# EAGLE design UsbPowerSupply (EAGLE 8.5.2)
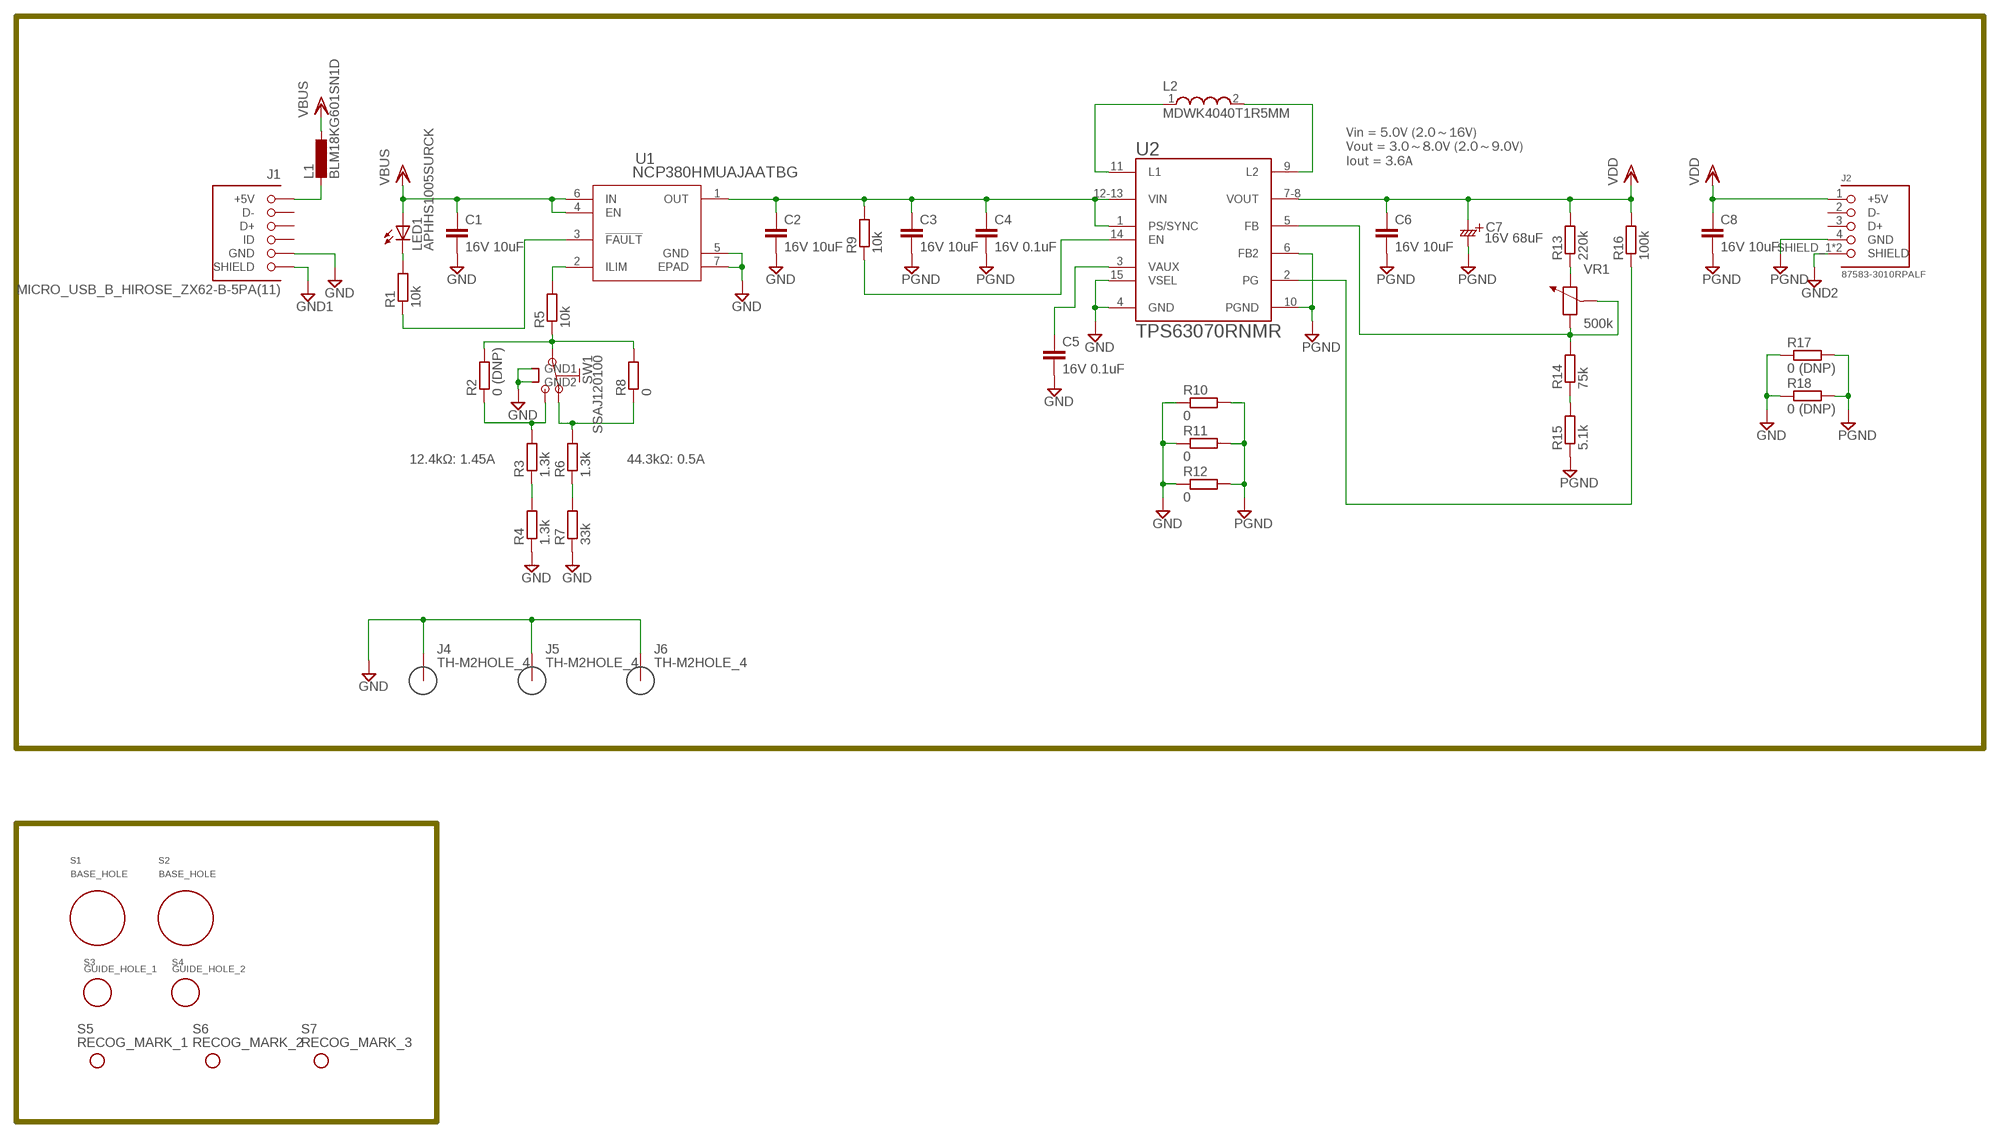
[diagram p0: schematic, sheet 1]

## Parts
C1  16V 10uF  C-EUC0603M  [C0603M]
C2  16V 10uF  C-EUC0603M  [C0603M]
C3  16V 10uF  C-EUC0603M  [C0603M]
C4  16V 0.1uF  C-EUC0402M  [C0402M]
C5  16V 0.1uF  C-EUC0402M  [C0402M]
C6  16V 10uF  C-EUC0603M  [C0603M]
C7  16V 68uF  EEFCX  [EEFCX_7343]
C8  16V 10uF  C-EUC0603M  [C0603M]
J1  MICRO_USB_B_HIROSE_ZX62-B-5PA(11)  [USB_MICRO_B-HIROSE-ZX62-B-5PA(11)]
J2  87583-3010RPALF  [USB_A_FEMALE]
J4  TH-M2HOLE_4  [HOLE_M2_PHI4]
J5  TH-M2HOLE_4  [HOLE_M2_PHI4]
J6  TH-M2HOLE_4  [HOLE_M2_PHI4]
L1  BLM18KG601SN1D  L-EUL1608  [L1608]
L2  MDWK4040T1R5MM  WE-MAPI4020  [WE-MAPI_4020]
LED1  APHHS1005SURCK  LED  [1005]
R1  10k  R-EU_R0402R  [R0402R]
R2  0 (DNP)  R-EU_R0402R  [R0402R]
R3  1.3k  R-EU_R0402R  [R0402R]
R4  1.3k  R-EU_R0402R  [R0402R]
R5  10k  R-EU_R0402R  [R0402R]
R6  1.3k  R-EU_R0402R  [R0402R]
R7  33k  R-EU_R0402R  [R0402R]
R8  0  R-EU_R0402R  [R0402R]
R9  10k  R-EU_R0402R  [R0402R]
R10  0  R-EU_R0402R  [R0402R]
R11  0  R-EU_R0402R  [R0402R]
R12  0  R-EU_R0402R  [R0402R]
R13  220k  R-EU_R0402R  [R0402R]
R14  75k  R-EU_R0402R  [R0402R]
R15  5.1k  R-EU_R0402R  [R0402R]
R16  100k  R-EU_R0402R  [R0402R]
R17  0 (DNP)  R-EU_R0402R  [R0402R]
R18  0 (DNP)  R-EU_R0402R  [R0402R]
S1  BASE_HOLE  [BASE_HOLE]
S2  BASE_HOLE  [BASE_HOLE]
S3  GUIDE_HOLE_1  [GUIDE_HOLE]
S4  GUIDE_HOLE_2  [GUIDE_HOLE]
S5  RECOG_MARK_1  [RECOG_MARK]
S6  RECOG_MARK_2  [RECOG_MARK]
S7  RECOG_MARK_3  [RECOG_MARK]
SW1  SSAJ120100  [SSAJ120100]
U1  NCP380HMUAJAATBG  [NCP380_UDFN6]
U2  TPS63070RNMR  [QFN50P250X300X100-15N]
VR1  500k  VR3006  [VR_3006]

## Nets
EN: R9.1 U2.14(EN)
FB: R14.2 U2.5(FB) VR1.2(CENTER) VR1.3
GND: C1.2 C2.2 C5.2 J1.5(GND) J4.P$1 J5.P$1 J6.P$1 R4.1 R7.1 R10.1 R11.1 R12.1 R17.1 R18.1 SW1.4(GND1) SW1.5(GND2) U1.5(GND) U1.7(EPAD) U2.4(GND) U2.15(VSEL)
GND1: J1.P$1(SHIELD) J1.P$2(SHIELD) J1.P$3(SHIELD) J1.P$4(SHIELD) J1.P$5(SHIELD) J1.P$6(SHIELD)
GND2: J2.SHIELD_1(SHIELD) J2.SHIELD_2(SHIELD)
L1: L2.1 U2.11(L1)
L2: L2.2 U2.9(L2)
N$1: R14.1 R15.2
N$2: J1.1(+5V) L1.2
N$3: LED1.K R1.2
N$5: R1.1 U1.3(!FAULT)
N$6: R5.2 U1.2(ILIM)
N$7: R2.2 R5.1 R8.2 SW1.2
N$8: R13.1 VR1.1
N$9: R3.1 R4.2
N$10: R6.2 R8.1 SW1.3
N$11: R2.1 R3.2 SW1.1
N$12: R6.1 R7.2
PG: R16.1 U2.2(PG)
PGND: C3.2 C4.2 C6.2 C7.MINUS C8.2 J2.4(GND) R10.2 R11.2 R12.2 R15.1 R17.2 R18.2 U2.6(FB2) U2.10(PGND)
VAUX: C5.1 U2.3(VAUX)
VBUS: C1.1 L1.1 LED1.A U1.4(EN) U1.6(IN)
VBUS2: C2.1 C3.1 C4.1 R9.2 U1.1(OUT) U2.1(PS/SYNC) U2.12-13(VIN)
VDD: C6.1 C7.PLUS C8.1 J2.1(+5V) R13.2 R16.2 U2.7-8(VOUT)
Unconnected: J1.2(D-) J1.3(D+) J1.4(ID) J2.2(D-) J2.3(D+)

## Notes on the sheet
- Vin = 5.0V (2.0～16V)
  Vout = 3.0～8.0V (2.0～9.0V)
  Iout = 3.6A
- 12.4kΩ: 1.45A | 44.3kΩ: 0.5A

## Library data of the parts
C1-C3 C6 C8 = rcl:C-EU: CAPACITOR, European symbol; HEIGHT: 0.8
C4 C5 = rcl:C-EU: CAPACITOR, European symbol; HEIGHT: 0.5
C7 = capacitor:EEFCX; HEIGHT: 2.1
J1 = connector:MICRO_USB_B_HIROSE_ZX62-B-5PA(11): Connector Receptacle USB - micro B 2.0 5 Position Surface Mount, Right Angle, Horizontal Bottom Mount; DIGIKEY: H11634CT-ND; HEIGHT: 2.8; MOUSER: 798-ZX62-B-5PA11; NEWARK: 86P8793
J2 = USB_A_FEMALE:87583-3010RPALF
J4-J6 = Mac8:TH-M2; HEIGHT: 0.1
L1 = rcl:L-EU: INDUCTOR, European symbol; HEIGHT: 0.6
L2 = Wurth_Elektronik_Passive_rev15f:WE-MAPI: SMD Metal Alloy Power Inductor Characteristics Magnetic iron alloy allows high rated currents Compact design Magnetically shielded High current capability and handles high transient current spikes Low acoustic noise and low leakage flux noise Operating temperature: –40 °C to 125 °C Applications DC/DC-converter for high current power supplies DC/DC-converter for Field Programmable Gate Array (FPGA) POL-converters Portable power like PDA, digital camera Mainboards/graphic cards Battery powered devices Wireless communication devices Power supplies for smartphones, tablet PCs and other mobile devices <http://katalog.we-online.de/media/images/eisos/IndMAPI_pf2.jpg> Details see: http://katalog.we-online.de/en/pbs/WE-MAPI? Updated by Dan Xu 2014-07-08 2014 (C) Wurth Elektronik; HEIGHT: 2.1
LED1 = LED:LED; HEIGHT: 0.5
R1-R18 = rcl:R-EU_: RESISTOR, European symbol
S1 S2 = MountingSymbol:BASE_HOLE; HEIGHT: 0.1
S3 S4 = MountingSymbol:GUIDE_HOLE; HEIGHT: 0.1
S5-S7 = MountingSymbol:RECOG_MARK; HEIGHT: 0.1
SW1 = switch:SSAJ1*0100
U1 = USB_PowerSwitch:NCP380
U2 = TPS63070RNMR:TPS63070RNMR: Wide Input Voltage (2V-16V) Buck-Boost Converter 15-VQFN-HR; DESCRIPTION: Wide Input Voltage (2V-16V) Buck-Boost Converter 15-VQFN-HR; DIGI-KEY_PART_NUMBER: 296-44874-1-ND; DIGI-KEY_PURCHASE_URL: https://www.digikey.jp/product-detail/en/texas-instruments/TPS63070RNMR/296-44874-1-ND/6217416?WT.z_cid=ref_snapeda&utm_source=snapeda&utm_medium=aggregator&utm_campaign=buynow; MF: Texas Instruments; MP: TPS63070RNMR; PACKAGE: VQFN-15 Texas Instruments
VR1 = resistor:VR

## Board
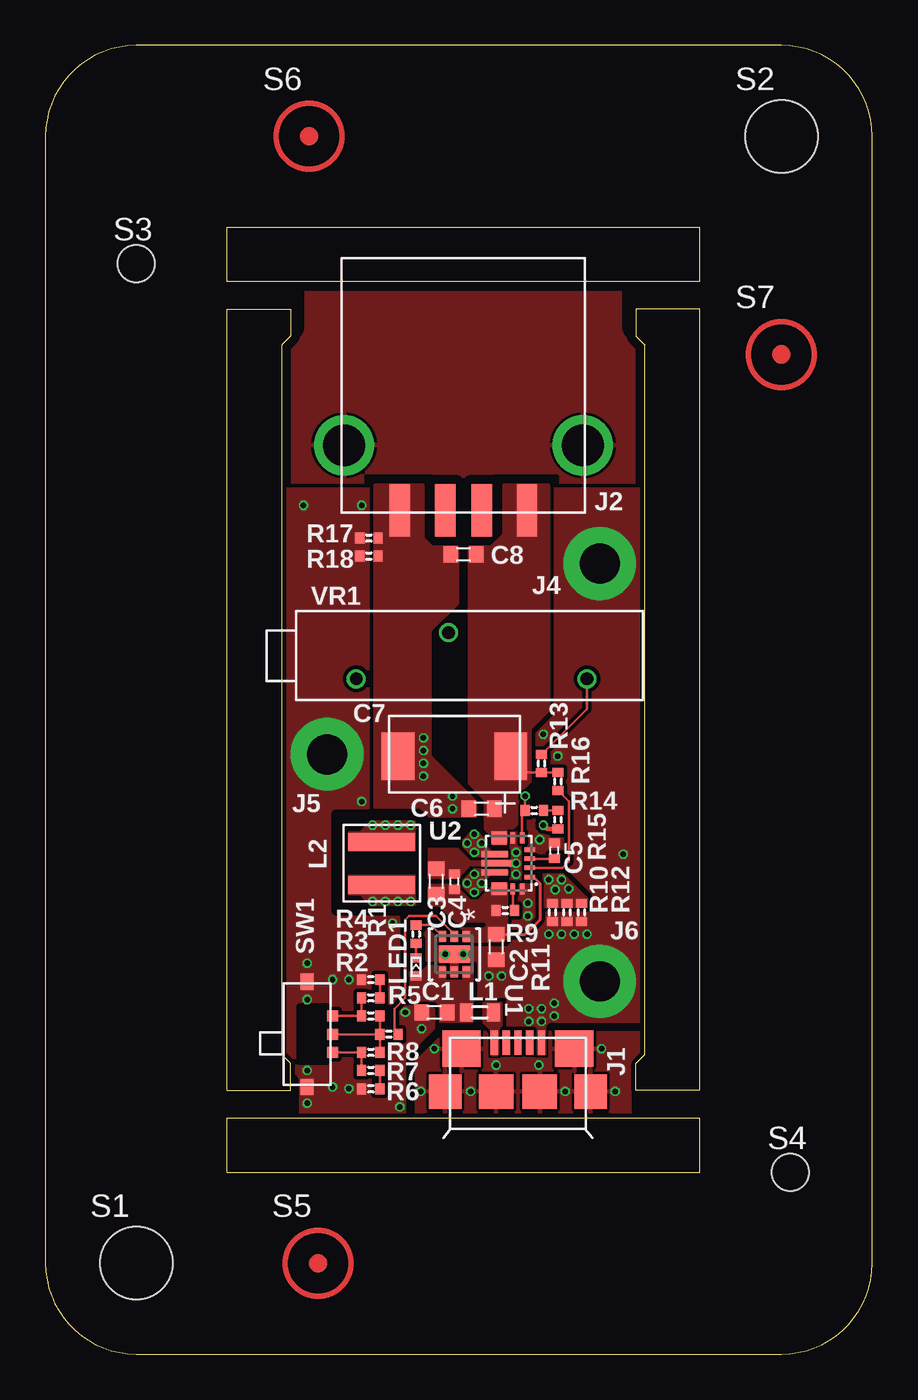
[diagram p1: board, top side]
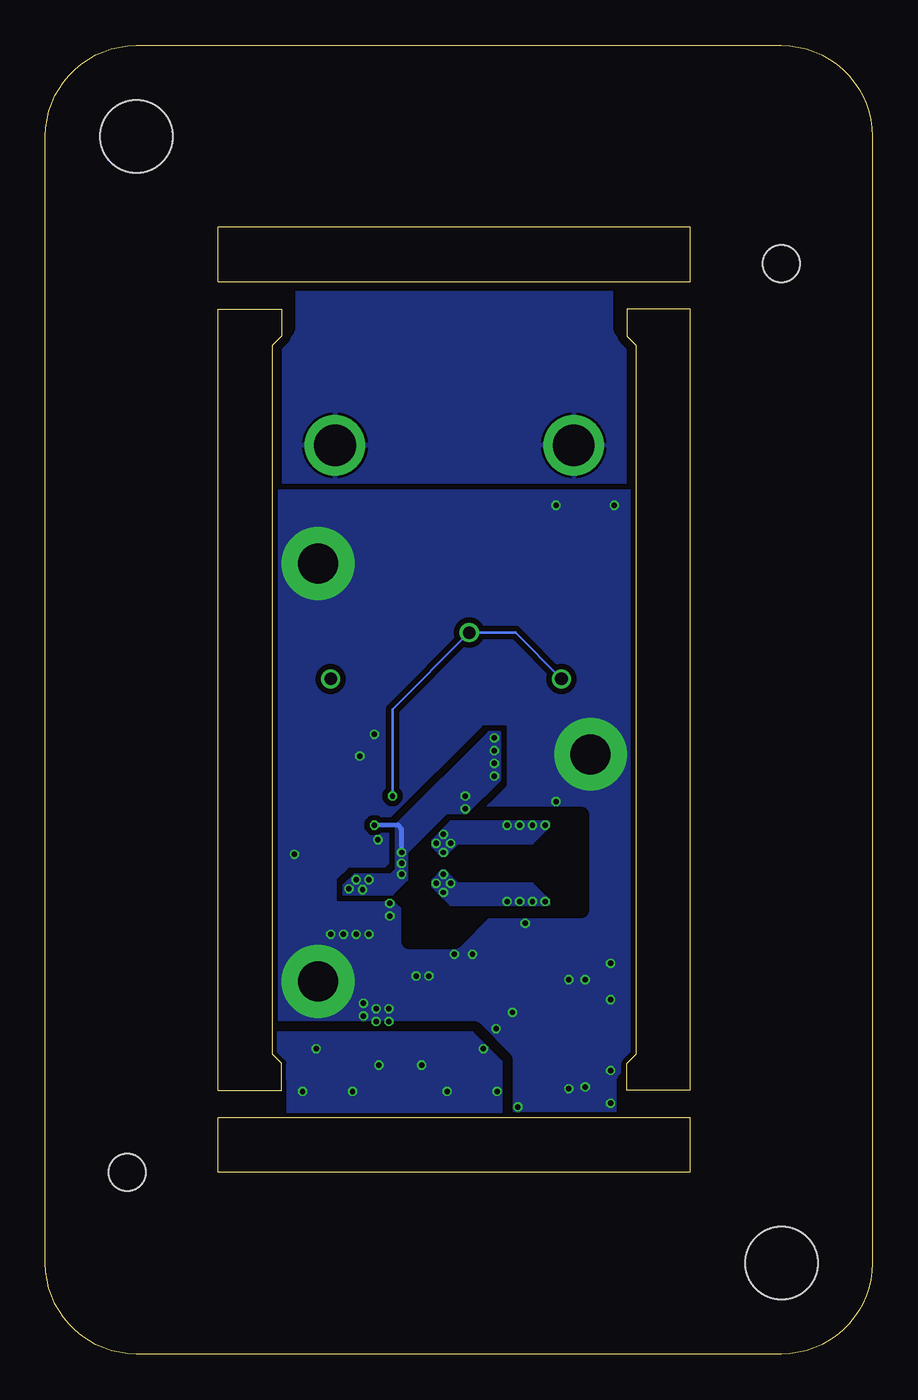
[diagram p2: board, bottom side, seen from below]

Size 45.5 x 72 mm. Coordinates in mm from the lower left corner, seen from the top.
Outline: 10,13 36,13 36,10 10,10 10,13
Outline: 33,16.5 33,55.5 32.5,56 32.5,57.5 36,57.5 36,14.5 32.5,14.5 32.5,16 33,16.5
Outline: 36,59 10,59 10,62 36,62 36,59
Outline: 13,55.5 13,16.5 13.5,16 13.5,14.5 10,14.5 10,57.5 13.5,57.5 13.5,56 13,55.5
Outline: 0,67 0,5 arc90 5,0 40.5,0 arc90 45.5,5 45.5,67 arc90 40.5,72 5,72 arc90 0,67
Copper layers (1*16): Top 0.035mm / dielectric 1.5mm / Bottom 0.035mm
Design rules "PCBgogo_5mil_drill_0_2mm *": minimum track width 5mil, minimum drill 0.2mm, track to track 5mil, track to pad 5mil, pad to pad 5mil, via to via 5mil, smd to smd 0mil, copper to edge 10mil, drill to drill 6mil, minimum pad ring 6mil, minimum via ring 0.1mm, stop-mask expansion 3mil, vias tented up to drill 0.5mm, thermal gap 6mil
tRestrict: 17 lines
bRestrict: 14 lines

### Footprints (pad centres in the part's own frame; a part is rotated, then mirrored left to right if it is on the bottom)
C0603M = smd 0.8 x 0.9: 1 -0.7,0; 2 0.7,0
C0402M = smd 0.5 x 0.6: 1 -0.425,0; 2 0.425,0
EEFCX_7343 = smd 1.8 x 2.6: MINUS 3.1,0.1; PLUS -3.1,0.1
USB_MICRO_B-HIROSE-ZX62-B-5PA(11) = smd 0.4 x 1.35: 1 -1.3,4.125; 2 -0.65,4.125; 3 0,4.125; 4 0.65,4.125; 5 1.3,4.125 | smd 2.1 x 2: P$1 3.1,3.8; P$2 -3.1,3.8 | smd 1.8 x 1.9: P$3 -4,1.45; P$6 4,1.45 | smd 1.9 x 1.9: P$4 -1.2,1.45; P$5 1.2,1.45
USB_A_FEMALE = smd 1.12 x 2.88: 1 -3.5,3.58; 2 -1,3.58; 3 1,3.58; 4 3.5,3.58 | drill 2.3: SHIELD_1 -6.57,0; SHIELD_2 6.57,0
HOLE_M2_PHI4 = drill 2.2 pad 4: P$1 0,0
L1608 = smd 0.7 x 1: 1 -0.75,0; 2 0.75,0
WE-MAPI_4020 = smd 0.98 x 3.7: 1 -1.185,0; 2 1.185,0
1005 = smd 0.5 x 0.6: A -0.5,0; K 0.5,0
R0402R = smd 0.5 x 0.6: 1 -0.5,0; 2 0.5,0
BASE_HOLE = hole 4: 0,0
GUIDE_HOLE = hole 2.05: 0,0
SSAJ120100 = smd 0.6 x 0.6: 1 -1,1.4; 2 0,1.4; 3 1,1.4 | smd 0.9 x 0.7: 4 -2.9,0; 5 2.9,0
NCP380_UDFN6 = smd 0.6 x 0.4: 1 -0.975,0.65; 2 -0.975,0; 3 -0.975,-0.65; 4 0.975,-0.65; 5 0.975,0; 6 0.975,0.65 | smd 0.95 x 1.7: 7 0,0
QFN50P250X300X100-15N = smd 0.6 x 0.25: 1 -1.15,0.75; 2 -1.15,0.25; 3 -1.15,-0.25; 4 -1.15,-0.75 | smd 0.25 x 0.6: 5 -0.725,-1.4; 6 -0.225,-1.4; 14 -0.225,1.4; 15 -0.725,1.4 | smd 0.85 x 0.7: 7-8 0.525,-1.4; 12-13 0.525,1.4 | smd 1.45 x 0.35: 9 0.775,-0.5; 11 0.775,0.5 | smd 1.8 x 0.35: 10 0.6,0
VR_3006 = drill 0.7: 1 -7.62,1.27; 2 0,-1.27; 3 5.08,1.27

### Placement (x,y rotation side)
C1  21.4,18.8 180 top
C2  24.8,22.4 270 top
C3  21.5,26 90 top
C4  22.5,26 90 top
C5  28,27.7 90 top
C6  24,30 180 top
C7  22.5,33 180 top
C8  23,44 180 top
J1  26,13 0 top
J2  23,50 180 top
J4  30.5,43.5 0 top
J5  15.5,33 0 top
J6  30.5,20.5 0 top
L1  23.9,18.8 0 top
L2  18.5,27 90 top
LED1  20.4,21.3 90 top
R1  20.4,23.1 270 top
R2  17.9,18.6 0 top
R3  17.9,19.6 180 top
R4  17.9,20.6 0 top
R5  18.9,17.6 0 top
R6  17.9,15.6 180 top
R7  17.9,14.6 0 top
R8  17.9,16.6 0 top
R9  25.3,24.4 180 top
R10  28.7,24.3 90 top
R11  27.9,24.3 90 top
R12  29.5,24.3 90 top
R13  27.3,32.5 270 top
R14  26.9,29.9 180 top
R15  28.2,29.4 90 top
R16  28.2,31.5 90 top
R17  17.8,44.9 0 top
R18  17.8,43.9 0 top
S1  5,5 0 top
S2  40.5,67 0 top
S3  5,60 0 top
S4  41,10 0 top
S5  15,5 0 top
S6  14.5,67 0 top
S7  40.5,55 0 top
SW1  14.4,17.6 270 top
U1  22.5,22 270 top
U2  25.5,27 180 top
VR1  22.18,38.42 180 top

### Tracks (layer width: path | path; a pad name or v marks a point on that pad's centre or on a via)
EN
  Top 0.127: U2.14 25.73,24.48 R9.1
FB  (via drill 0.3)
  Top 0.127: U2.5 26.23,29.73 R14.2 v26.4,30.7
  Bottom 0.127: VR1.3 19.64,39.69 VR1.2 26.4,35.47 v26.4,30.7
GND  (via drill 0.3)
  other vias: 27.7,23.1 22,22 23,22 16.7,20.6 16.7,14.6 20.7,17.9 19.8,18.8 24.4,20.8 25.1,20.8 27.3,18.3 28,18.6 26.6,18.3 27.3,19 28,19.3 26.6,19 14.4,21.5 15.8,20.6 15.8,14.7 14.4,19.5 14.4,15.6 14.4,13.8 27.2,28.3 26.55,24.1 26.55,24.8 28.4,23.1 29.1,23.1 29.8,23.1 31.8,27.5 19.5,13.6 19.1,23.7 14.2,46.7 17.4,46.7 17.4,30.4 28.2,32.9 27.4,34.1
  pour Top (isolate 0.203, rank 6, no thermals): 13,12.5 33,12.5 33,56 13,56
  pour Top (no thermals): 27.1,16.5 27.1,18.5 27.5,18.5 27.5,16.5
  pour Bottom (isolate 0.305, rank 6, no thermals): 13,12.5 33,12.5 33,56 13,56
GND1  (via drill 0.3)
  other vias: 21.4,16.8 24.8,15.9 27.15,15.9 30.6,16.8 31.35,14.45 28.6,14.45 23.4,14.45 20.65,14.45
  pour Top (rank 5): 20.4,12.9 33.1,12.9 33.1,17.7 22,17.7 20.4,16.1
  pour Bottom (rank 5): 20.4,12.9 33.1,12.9 33.1,17.7 22,17.7 20.4,16.1
GND2
  pour Top (isolate 0.508, rank 5): 12,48 34,48 34,60 12,60
  pour Bottom (isolate 0.508, rank 5): 12,48 34,48 34,60 12,60
L1  (via drill 0.3)
  other vias: 23.6,26.4 24,25.9 23.2,25.9 23.6,25.4 20.1,24.9 18,24.9 19.4,24.9 18.7,24.9
  pour Top (rank 2, no thermals): 25.4,26.7 23.6,26.7 23,26.1 23,25.7 23.5,25.2 23.7,25.2 24.2,25.7 24.2,26.1 24.5,26.4 25.4,26.4
  pour Top (no thermals): 20.3,24.7 20.3,26.3 16.7,26.3 16.7,25.3 17.3,25.3 17.9,24.7
  pour Bottom (no thermals): 17.8,24.7 23.2,24.7 24.2,25.7 24.2,26.1 23.7,26.6 23.5,26.6 22.8,25.9 18.7,25.9 17.8,25
L2  (via drill 0.3)
  other vias: 23.2,28.1 23.6,27.6 24,28.1 23.6,28.6 19.4,29.1 20.1,29.1 18.7,29.1 18,29.1
  pour Top (rank 2, no thermals): 25.4,27.4 23.5,27.4 23,27.9 23,28.3 23.5,28.8 23.7,28.8 24.2,28.3 24.2,28 24.6,27.6 25.4,27.6
  pour Top (no thermals): 20.3,27.7 20.3,29.3 17.9,29.3 17.3,28.7 16.7,28.7 16.7,27.7
  pour Bottom (no thermals): 24.2,28.3 23.2,29.3 17.8,29.3 17.8,29 18.7,28.1 22.8,28.1 23.5,27.4 23.7,27.4 24.2,27.9
N$1
  Top 0.127: R14.1 R15.2
N$2
  pour Top (no thermals): 24.9,16.5 24.9,17.9 25.1,18.1 25.1,19.3 24.1,19.3 24.1,18.25 24.55,17.8 24.55,16.5
N$3
  Top 0.127: LED1.K R1.2
N$5
  Top 0.127: R1.1 21.23,23.6 U1.3
N$6
  Top 0.127: U1.2 22.5,23.1 21.5,24.1 20,24.1 19.8,23.9 19.8,19.6 19.2,19 19.2,17.8 R5.2
N$7
  Top 0.127: R5.1 SW1.2 | R2.2 R5.1 | R8.2 R5.1
N$8
  Top 0.127: R13.1 29.8,35.5 VR1.1
N$9
  Top 0.127: R3.1 R4.2
N$10
  Top 0.127: SW1.3 R8.1 R6.2
N$11
  Top 0.127: SW1.1 R2.1 R3.2
N$12
  Top 0.127: R6.1 R7.2
PG
  Top 0.127: U2.2 28.45,26.75 28.8,27.1 28.8,30.4 R16.1
PGND  (via drill 0.3)
  Top 0.254: R15.1 27.6,28.9 v27.4,29.1
  Bottom 0.254: v27.4,29.1 26.1,29.1 25.9,28.9 v25.9,27.6
  other vias: 25.9,27 25.9,26.4 20.8,31.8 20.8,32.5 20.8,33.2 20.8,33.9 22.4,30.7 22.4,30 27.7,26.1 28.4,26.1 28.05,25.55 28.8,25.6
  pour Top (isolate 0.152, no thermals): 26.2,26.15 26.2,28.7 25.6,28.7 25.6,27.1 23.4,27.1 22.7,27.8 21.1,27.8 21.1,26.2 22.7,26.2 23.4,26.9 25.6,26.9 25.6,26.15
  pour Top (rank 2, no thermals): 23.7,29.6 23.7,30.4 21.2,32.9 21.2,39.8 22.7,41.3 22.7,44.4 21.3,44.4 20.8,44.9 20.8,47.8 18.1,47.8 18.1,30.1 20.6,30.1 21.1,29.6
  pour Bottom (rank 2, no thermals): 26.2,26.15 25.6,26.15 25.6,27.6 23.4,29.8 22.3,29.8 20.5,31.6 20.5,34.2 21.1,34.2 26.2,29.1
  pour Top (no thermals): 27.4,26.4 28.5,26.4 29.8,25.1 29.8,24.6 27.4,24.6
  pour Bottom (no thermals): 29.1,25.3 29.1,25.8 28.5,26.4 26.5,26.4 26.2,26.7 25.6,26.7 25.6,26.1 26.4,25.3
VAUX
  Top 0.127: U2.3 27.98,27.25 C5.1
VBUS
  pour Top (no thermals): 23.5,18.3 23.5,21.3 23,21.3 23,20.5 22,20.5 22,21.3 21,21.3 20.7,21 20.1,21 20.1,19.5 21.4,19.5 21.7,19.2 21.7,18.3
VBUS2
  Top 0.152: C2.1 26.4,23.1 27.2,23.9 27.2,25.9 26.85,26.25 U2.1
  pour Top (no thermals): 23,22.7 25.2,22.7 25.4,22.9 25.4,25.9 24.6,25.9 24.6,25.75 23.8,24.95 23.4,24.95 22.75,25.6 22.75,25.8 21.1,25.8 21.1,24.3 22,24.3 23,23.3
VDD
  Top 0.127: C7.PLUS 26.5,32 R13.2 R16.2
  pour Top (rank 2, no thermals): 25.4,28.1 25.4,28.6 26,29.2 26,30.8 26.7,31.5 26.7,34.4 27.7,35.4 27.7,47.8 25.2,47.8 25.2,45.1 24.5,44.4 23.3,44.4 23.3,31.4 24.2,30.5 24.2,28.9 24.6,28.5 24.6,28.1